# Altium schematic sheet Voltage and Charge Control.SchDoc
size A4
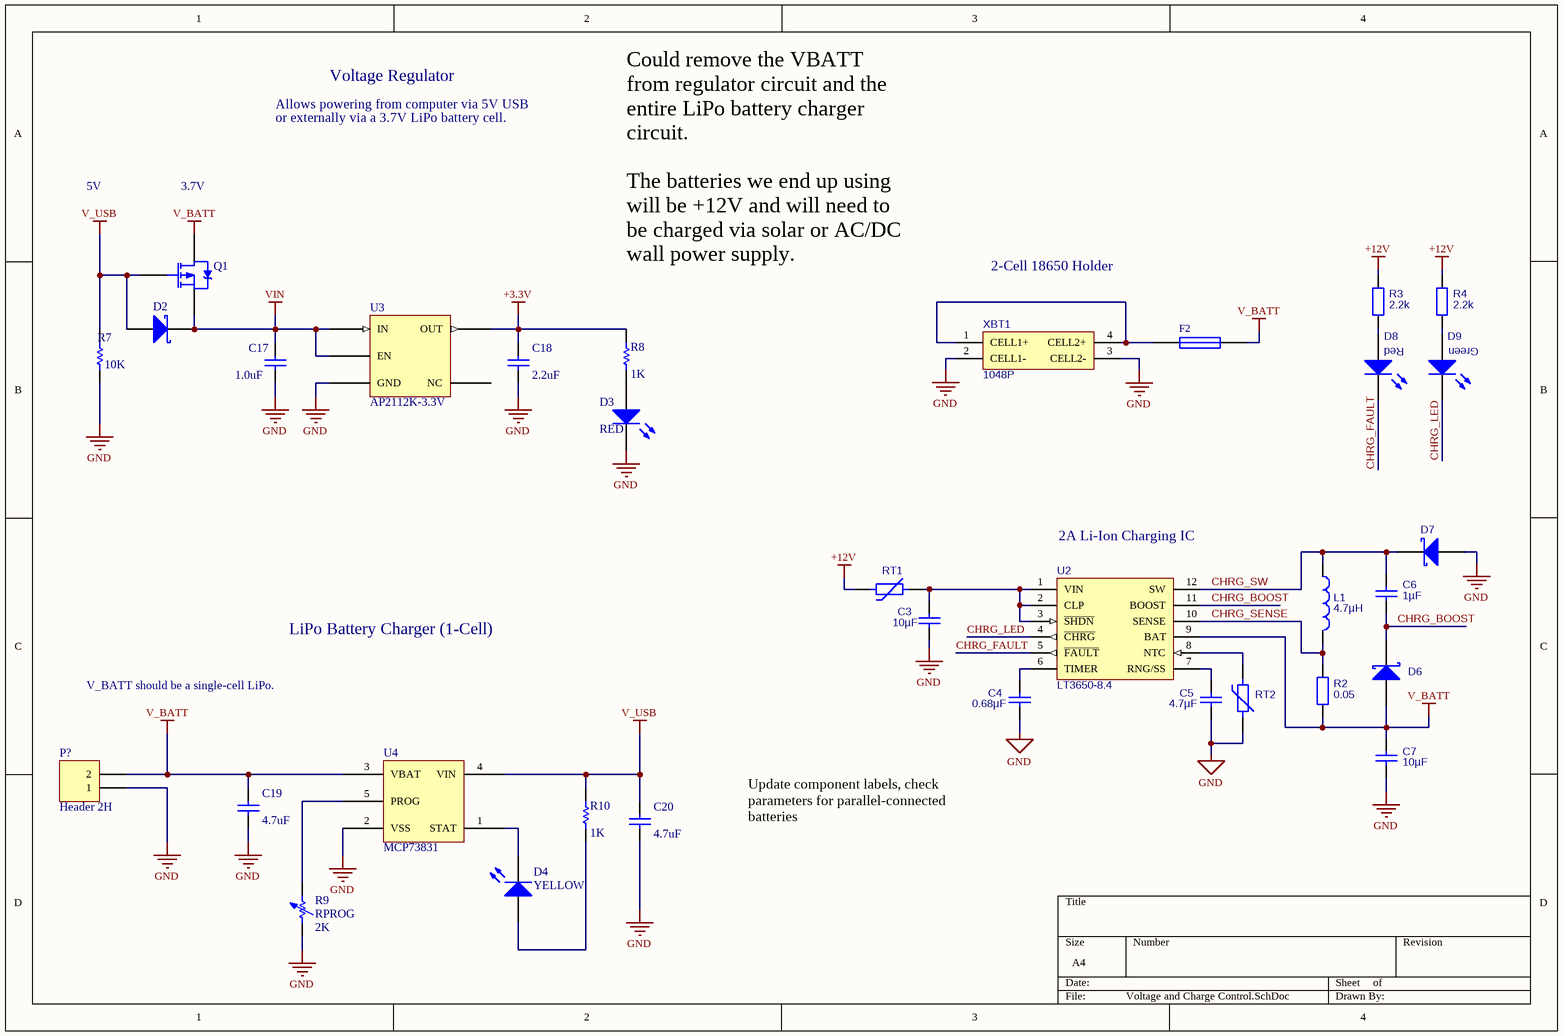
[diagram p0: Voltage and Charge Control.SchDoc]

## Parts
C3  value 10µF  [TDK C-Series (3216)]
C4  value 0.68µF  [TDK C-Series (1608)]
C5  value 4.7µF  [TDK C-Series (2012)]
C6  value 1µF  [TDK C-Series (1608)]
C7  value 10µF  [TDK C-Series (3216)]
C17  value 1.0uF  [RAD-0.3]  (hidden comment: Cap)
C18  value 2.2uF  [RAD-0.3]  (hidden comment: Cap)
C19  value 4.7uF  [RAD-0.3]  (hidden comment: Cap)
C20  value 4.7uF  [RAD-0.3]  (hidden comment: Cap)
D2  D Schottky  [SMB]  (value not drawn)
D3  RED  [3.2X1.6X1.1]
D4  YELLOW  [3.2X1.6X1.1]
D6  D Schottky  [NXP PMEG6020AELRX (SOD-123)]  (value not drawn)
D7  D Schottky  [NXP PMEG6020AELRX (SOD-123)]  (value not drawn)
D8  LTST-C193KGKT-5A  [Lite-On LTST-C193K-Series (1608)]  (value not drawn)
D9  LTST-C193KGKT-5A  [Lite-On LTST-C193K-Series (1608)]  (value not drawn)
F2  Fuse 1  [Bel Fuse C1F-Series (3216)]  (value not drawn)
L1  value 4.7µH  [Bourns SRU8028-Series]  (hidden comment: Inductor)
P?  Header 2H  [HDR1X2H]
Q1  PMOS-2  [TO-220AB]  (value not drawn)
R2  value 0.05  [Panasonic ERJ-Series (1608)]
R3  value 2.2k  [Panasonic ERJ-Series (1608)]
R4  value 2.2k  [Panasonic ERJ-Series (1608)]
R7  value 10K  [AXIAL-0.3]  (hidden comment: Res1)
R8  value 1K  [AXIAL-0.3]  (hidden comment: Res1)
R9  RPROG  value 2K  [AXIAL-0.7]
R10  value 1K  [AXIAL-0.3]  (hidden comment: Res1)
RT1  Thermistor  [Bel Fuse 0ZCG-Series (4532)]  (value not drawn)
RT2  Thermistor  [TDK NTCG-Series (1608)]  (value not drawn)
U2  LT3650-8.4  [Linear Technology LT3650-8.4 (12-TSSOP)]
U3  AP2112K-3.3V
U4  MCP73831
XBT1  1048P  [KEYSTONE 1048P]

## Nets
+3.3V: C18.2 R8.2 U3.5(OUT)
+12V: R3.2 R4.2 RT1.1
GND: C3.2 C4.2 C5.2 C7.2 C17.1 C18.1 C19.1 C20.1 D3.2(K) D7.1(A) P?.1 R7.1 R9.1 RT2.2 U3.2(GND) U4.2(VSS) XBT1.2(CELL1-) XBT1.3(CELL2-)
V_BATT: C7.1 C19.2 D6.1(A) F2.2 P?.2 Q1.2(D) R2.1 U2.9(BAT) U4.3(VBAT)
V_USB: C20.2 D2.1(A) Q1.1(G) R7.2 R10.2 U4.4(VIN)
VIN: C17.2 D2.2(K) Q1.3(S) U3.1(IN) U3.3(EN)
CHRG_BOOST: C6.1 D6.2(K) U2.11(BOOST)
CHRG_FAULT: D8.2(K) U2.5(~{FAULT})
CHRG_LED: D9.2(K) U2.4(~{CHRG})
CHRG_SENSE: L1.2 R2.2 U2.10(SENSE)
CHRG_SW: C6.2 D7.2(K) L1.1 U2.12(SW)
NetC3_1: C3.1 RT1.2 U2.1(VIN) U2.2(CLP) U2.3(~{SHDN})
NetC4_1: C4.1 U2.6(TIMER)
NetC5_1: C5.1 U2.7(RNG/SS)
NetD3_1: D3.1(A) R8.1
NetD4_1: D4.1(A) R10.1
NetD4_2: D4.2(K) U4.1(STAT)
NetD8_1: D8.1(A) R3.1
NetD9_1: D9.1(A) R4.1
NetF2_1: F2.1 XBT1.1(CELL1+) XBT1.4(CELL2+)
NetR9_2: R9.2 U4.5(PROG)
NetRT2_1: RT2.1 U2.8(NTC)

Not connected (* = marked no-connect by the designer): U3 4(NC)

## Notes on the sheet
- Allows powering from computer via 5V USB
- Voltage Regulator
- or externally via a 3.7V LiPo battery cell.
- 5V
- 3.7V
- (near R8) Could remove the VBATT from regulator circuit and the entire LiPo battery charger circuit.
  The batteries we end up using will be +12V and will need to be charged via solar or AC/DC wall power supply.
- 2-Cell 18650 Holder
- (near D8) Red
- (near D9) Green
- (near U2) 2A Li-Ion Charging IC
- LiPo Battery Charger (1-Cell)
- V_BATT should be a single-cell LiPo.
- Update component labels, check parameters for parallel-connected batteries

## Library data of the parts
C3-C7 C17-C20 = Cap: Capacitor; Published: 8-Jun-2000; LatestRevisionDate: 17-Jul-2002; LatestRevisionNote: Re-released for DXP Platform.; PackageReference: RAD-0.3; Publisher: Altium Limited; PackageDescription: Radial Cap, Thru-Hole; 2 Leads; 0.3 in Pin Spacing
  C3 C7: Supplier 1: Digi-Key; Supplier Part Number 1: 445-7705-1-ND
  C4: Supplier 1: Digi-Key; Supplier Part Number 1: 445-5129-1-ND
  C5: Supplier 1: Digi-Key; Supplier Part Number 1: 445-6859-1-ND
  C6: Supplier 1: Digi-Key; Supplier Part Number 1: 445-5956-1-ND
D2 = D Schottky: Schottky Diode; Published: 8-Jun-2000; LatestRevisionDate: 17-Jul-2002; LatestRevisionNote: Re-released for DXP Platform.; PackageReference: SMB; Publisher: Altium Limited; PackageDescription: DO-214-AA/SMB; 2 C-Bend Leads; Body 5.3 x 3.6 mm, inc. leads (LxW); Code_JEDEC: DO-214-AA; Supplier 1: Digi-Key; Supplier Part Number 1: 497-3381-1-ND
D3 D4 = LED2: Typical RED, GREEN, YELLOW, AMBER GaAs LED; Published: 8-Jun-2000; LatestRevisionDate: 17-Jul-2002; LatestRevisionNote: Re-released for DXP Platform.; PackageVersion: Feb-2002; PackageReference: 3.2X1.6X1.1; Publisher: Altium Limited; PackageDescription: SM LED; 2 Flat Leads
D6 D7 = D Schottky: Schottky Diode; pin to pad: 1>2 2>1; Published: 8-Jun-2000; LatestRevisionDate: 17-Jul-2002; LatestRevisionNote: Re-released for DXP Platform.; Publisher: Altium Limited; Supplier 1: Digi-Key; Supplier Part Number 1: 568-12710-1-ND
D8 D9 = LED0: Typical INFRARED GaAs LED; Published: 8-Jun-2000; LatestRevisionDate: 08-Jul-2005; LatestRevisionNote: Mech Layer 1 removed.; PackageReference: LED-0; Publisher: Altium Limited; PackageDescription: LED; 2 Leads; Supplier 1: Digi-Key
  D8: Supplier Part Number 1: 160-1830-1-ND
  D9: Supplier Part Number 1: 160-1828-1-ND
F2 = Fuse 1: Fuse; Published: 8-Jun-2000; LatestRevisionDate: 17-Jul-2002; LatestRevisionNote: Re-released for DXP Platform.; PackageReference: PIN-W2/E2.8; Publisher: Altium Limited; PackageDescription: Thru-Hole; 2 Leads; Supplier 1: Digi-Key; Supplier Part Number 1: 507-1888-1-ND
L1 = Inductor: Code_IEC: 1005; Published: 8-Jun-2000; LatestRevisionDate: 29-May-2009; LatestRevisionNote: IPC-7351 Footprint Added.; PackageReference: 0402-A; Publisher: Altium Limited; PackageDescription: Chip Inductor; Code_JEITA: 0402; Supplier 1: Digi-Key; Supplier Part Number 1: SRU8028-4R7YCT-ND
P? = Header 2H: Header, 2-Pin, Right Angle; LatestRevisionDate: 17-Jul-2002; LatestRevisionNote: Re-released for DXP Platform.; Publisher: Altium Limited
Q1 = PMOS-2: P-Channel Power MOSFET; Note: Pin 4 not drawn and electrically connected to Pin 2.; Published: 8-Jun-2000; LatestRevisionDate: 17-Jul-2002; LatestRevisionNote: Re-released for DXP Platform.; DatasheetVersion: PD-9.390D; PackageVersion: Feb-1997; PackageReference: TO-220AB; Publisher: Altium Limited; PackageDescription: TO, Thru-Hole, Vertical, Heatsink Mounted; 3 In-Line Leads; Pitch 2.54 mm; ComponentLink1Description: Manufacturer Link; ComponentLink1URL: http://www.irf.com/
R2-R4 = Res2: Resistor; Published: 8-Jun-2000; LatestRevisionDate: 17-Jul-2002; LatestRevisionNote: Re-released for DXP Platform.; PackageReference: AXIAL-0.4; Publisher: Altium Limited; PackageDescription: Axial Device, Thru-Hole; 2 Leads; 0.4 in Pin Spacing; Supplier 1: Digi-Key
  R2: Supplier Part Number 1: P17472CT-ND
  R3 R4: Supplier Part Number 1: P2.20KHCT-ND
R7 R8 R10 = Res1: Resistor; Published: 8-Jun-2000; LatestRevisionDate: 17-Jul-2002; LatestRevisionNote: Re-released for DXP Platform.; PackageReference: AXIAL-0.3; Publisher: Altium Limited; PackageDescription: Axial Device, Thru-Hole; 2 Leads; 0.3 in Pin Spacing
R9 = Res Adj1: Variable Resistor; Set Position: 0.5; Published: 8-Jun-2000; LatestRevisionDate: 17-Jul-2002; LatestRevisionNote: Re-released for DXP Platform.; PackageReference: AXIAL-0.7; Publisher: Altium Limited; PackageDescription: Axial Device, Thru-Hole; 2 Leads; 0.7 in Pin Spacing
U2 = Linear Technology LT3650-8.4: 2A 2-Cell Li-Ion Battery Charger; Supplier 1: Digi-Key; Supplier Part Number 1: LT3650EMSE-8.4#PBF-ND
U3 = AP2112K-3.3V: 3.3V Regulator; Supplier 1: Digi-Key; Supplier Part Number 1: AP2112K-3.3TRG1DICT-ND
U4 = MCP73831: LiPo Charge Controller; Supplier 1: Digi-Key; Supplier Part Number 1: MCP73831T-2ACI/OTCT-ND
XBT1 = Keystone 1048P: Dual 18650 Battery Holder; Supplier 1: Digi-Key; Supplier Part Number 1: 36-1048P-ND
RT1 RT2 = Thermistor: Supplier 1: Digi-Key
  RT1: Supplier Part Number 1: 507-1770-1-ND
  RT2: Supplier Part Number 1: 445-2554-1-ND